# Altium schematic sheet 02-Mezzanine.SchDoc: ECE453 Power
size A; Date: 4/25/2017; ApprovedBy: JSK; CheckedBy: JSK; Author: JSK; CompanyName: University of Wisconsin; DrawnBy: JSK; Engineer: JSK; Organization: ECE 315; Address1: College of Engineering; Address2: 1415 Engineering Drive; Address3: Madison, WI 53706; Address4: ECE 453 Fall 2022; Revision: A; SheetNumber: 2; SheetTotal: 2; AssemblyNumber: ECE453-F22-01
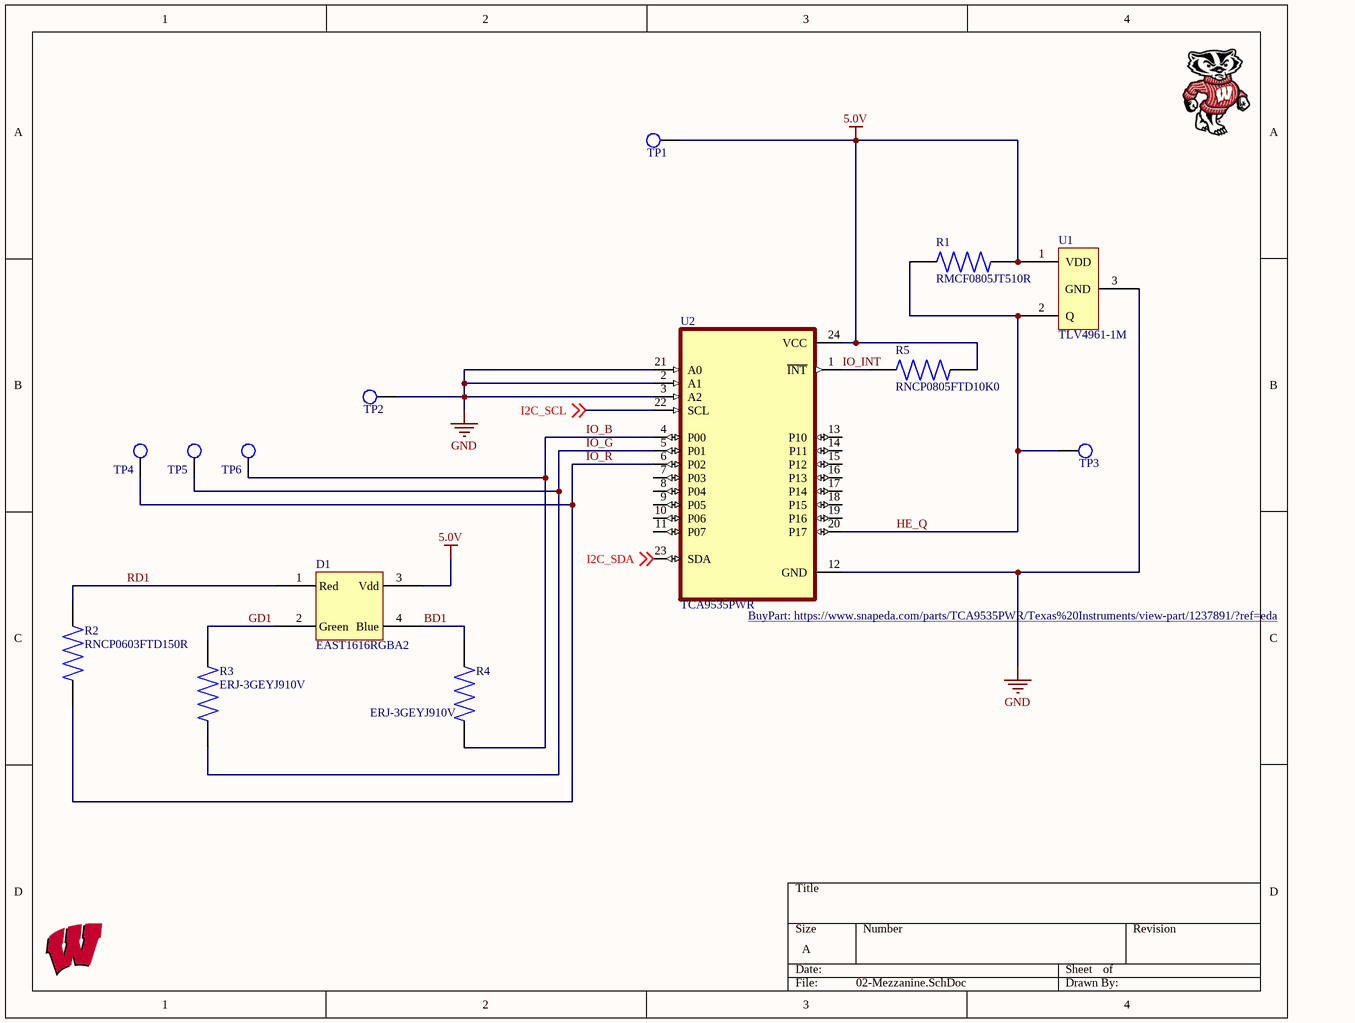
[diagram p0: 02-Mezzanine.SchDoc]

## Parts
D1  EAST1616RGBA2  [EAST1616RGBA2]
R1  RMCF0805JT510R  [RESC2012X65N]
R2  RNCP0603FTD150R  [RESC1508X50N]
R3  ERJ-3GEYJ910V  [RESC1608X55N]
R4  ERJ-3GEYJ910V  [RESC1608X55N]
R5  RNCP0805FTD10K0  [RESC2012X60N]
TP1  TP_1206  [TP-SMC-1206]  (value not drawn)
TP2  TP_1206  [TP-SMC-1206]  (value not drawn)
TP3  TP_1206  [TP-SMC-1206]  (value not drawn)
TP4  TP_1206  [TP-SMC-1206]  (value not drawn)
TP5  TP_1206  [TP-SMC-1206]  (value not drawn)
TP6  TP_1206  [TP-SMC-1206]  (value not drawn)
U1  TLV4961-1M  [SOT95P245X110-3N]
U2  TCA9535PWR  [SOP65P640X120-24N]

## Nets
5.0V: D1.3(Vdd) R1.2 R5.2 TP1.1 U1.1(VDD) U2.24(VCC)
GND: TP2.1 U1.3(GND) U2.2(A1) U2.3(A2) U2.12(GND) U2.21(A0)
BD1: D1.4(Blue) R4.2
GD1: D1.2(Green) R3.2
HE_Q: R1.1 TP3.1 U1.2(Q) U2.20(P17)
I2C_SCL: U2.22(SCL) ; off-sheet I2C_SCL
I2C_SDA: U2.23(SDA) ; off-sheet I2C_SDA
IO_B: R4.1 TP6.1 U2.4(P00)
IO_G: R3.1 TP5.1 U2.5(P01)
IO_INT: R5.1 U2.1(~{INT})
IO_R: R2.1 TP4.1 U2.6(P02)
RD1: D1.1(Red) R2.2

Not connected (* = marked no-connect by the designer): U2 7(P03) 8(P04) 9(P05) 10(P06) 11(P07) 13(P10) 14(P11) 15(P12) 16(P13) 17(P14) 18(P15) 19(P16)

## Library data of the parts
R3 R4 = ERJ-3GEYJ910V: Res Thick Film 0603 91 Ohm 5% 1/10W Ã‚Â±200ppm/Ã‚Â°C Molded SMD SMD Punched Carrier T/R; Package: None; Price: None; Value: *; MP: ERJ-3GEYJ910V; Availability: Unavailable
R5 = RNCP0805FTD10K0: 10 kOhms Â±1% 0.25W, 1/4W Chip Resistor 0805 _2012 Metric_ Anti-Sulfur, Moisture Resistant Thin Film; MF: Stackpole Electronics Inc; SnapEDA_Link: https://www.snapeda.com/parts/RNCP0805FTD10K0/Stackpole%20Electronics%20Inc/view-part/3229162/?ref=snap; Digi-Key_Purchase_URL: https://www.digikey.com/product-detail/en/stackpole-electronics-inc/RNCP0805FTD10K0/RNCP0805FTD10K0CT-ND/2240601?utm_source=snapeda&utm_medium=aggregator&utm_campaign=symbol; MP: RNCP0805FTD10K0; Digi-Key_Part_Number: RNCP0805FTD10K0CT-ND; Value: *; Package: 2012 Stackpole
TP1-TP6 = TP_1206: Test Point SMD 1206; Manufacturer: TE Connectivity (Tyco Electronics); Manufacturer Part Number: 1625854-1; Resistance Value: 0 Ohm; Temperature Coefficient: N/R; Supplier: Digi-Key; Stock 1: 31937; Pricing 1: 1=0.28, 10=0.261, 25=0.224, 50=0.1902, 100=0.1828, 250=0.1641, 500=0.1567, 1000=0.1306 (USD); Case Size: 1206; Dimension: 3.2 x 1.6 x 1.25mm; Family: RC; Mounting: Surface Mount; Operating Temperature: -55 to 125 C; Part No: 1625854-1; RoHS: Yes; Packaging: Tape and Reel; Termination Style: N/R; Terminal Pitch: N/R; Power Rating: N/R; Tolerance: N/R; ComponentLink1URL: https://datasheet.ciiva.com/6439/eng-ds-1773266-a-6439169.pdf; ComponentLink1Description: https://datasheet.ciiva.com/6439/eng-ds-1773266-a-6439169.pdf; ComponentLink2URL: https://datasheet.ciiva.com/30136/1773266-a-30136341.pdf; ComponentLink2Description: https://datasheet.ciiva.com/30136/1773266-a-30136341.pdf; ComponentLink3URL: https://datasheet.ciiva.com/6439/eng-ds-1773266-a-6439080.pdf; ComponentLink3Description: https://datasheet.ciiva.com/6439/eng-ds-1773266-a-6439080.pdf; ComponentLink4URL: https://datasheet.ciiva.com/6439/eng-ds-1773266-a-6439081.pdf; ComponentLink4Description: https://datasheet.ciiva.com/6439/eng-ds-1773266-a-6439081.pdf; ComponentLink5URL: https://datasheet.ciiva.com/6439/eng-ds-1773266-a-6439083.pdf; ComponentLink5Description: https://datasheet.ciiva.com/6439/eng-ds-1773266-a-6439083.pdf; Supplier Part Number: A106143CT-ND
U1 = TLV4961-1M: Hall Effect Sensor
U2 = TCA9535PWR: Remote 16-Bit I2C and SMBus, Low-Power I/O Expander With Interrupt Output and Config Registers 24-TSSOP -40 to 85; MF: Texas Instruments; Texas_Instruments-Purchase-URL: https://snapeda.com/shop?store=Texas+Instruments&id=1237891; SnapEDA_Link: https://www.snapeda.com/parts/TCA9535PWR/Texas%20Instruments/view-part/1237891/?ref=snap; Availability: Good; Price: None; MP: TCA9535PWR; DigiKey-Purchase-URL: https://snapeda.com/shop?store=DigiKey&id=1237891; Package: TSSOP-24 Texas Instruments; Mouser-Purchase-URL: https://snapeda.com/shop?store=Mouser&id=1237891; Arrow_Electronics-Purchase-URL: https://snapeda.com/shop?store=Arrow+Electronics&id=1237891; Value: *; BuyPart: https://www.snapeda.com/parts/TCA9535PWR/Texas%20Instruments/view-part/1237891/?ref=eda
R1 = RMCF0805JT510R: Package: None; Price: None; Value: *; MP: RMCF0805JT510R; Availability: Unavailable
R2 = RNCP0603FTD150R: Package: None; Price: None; Value: *; MP: RNCP0603FTD150R; Availability: Unavailable